# EAGLE design Sensor-TSL2591 (EAGLE 7.7.0)
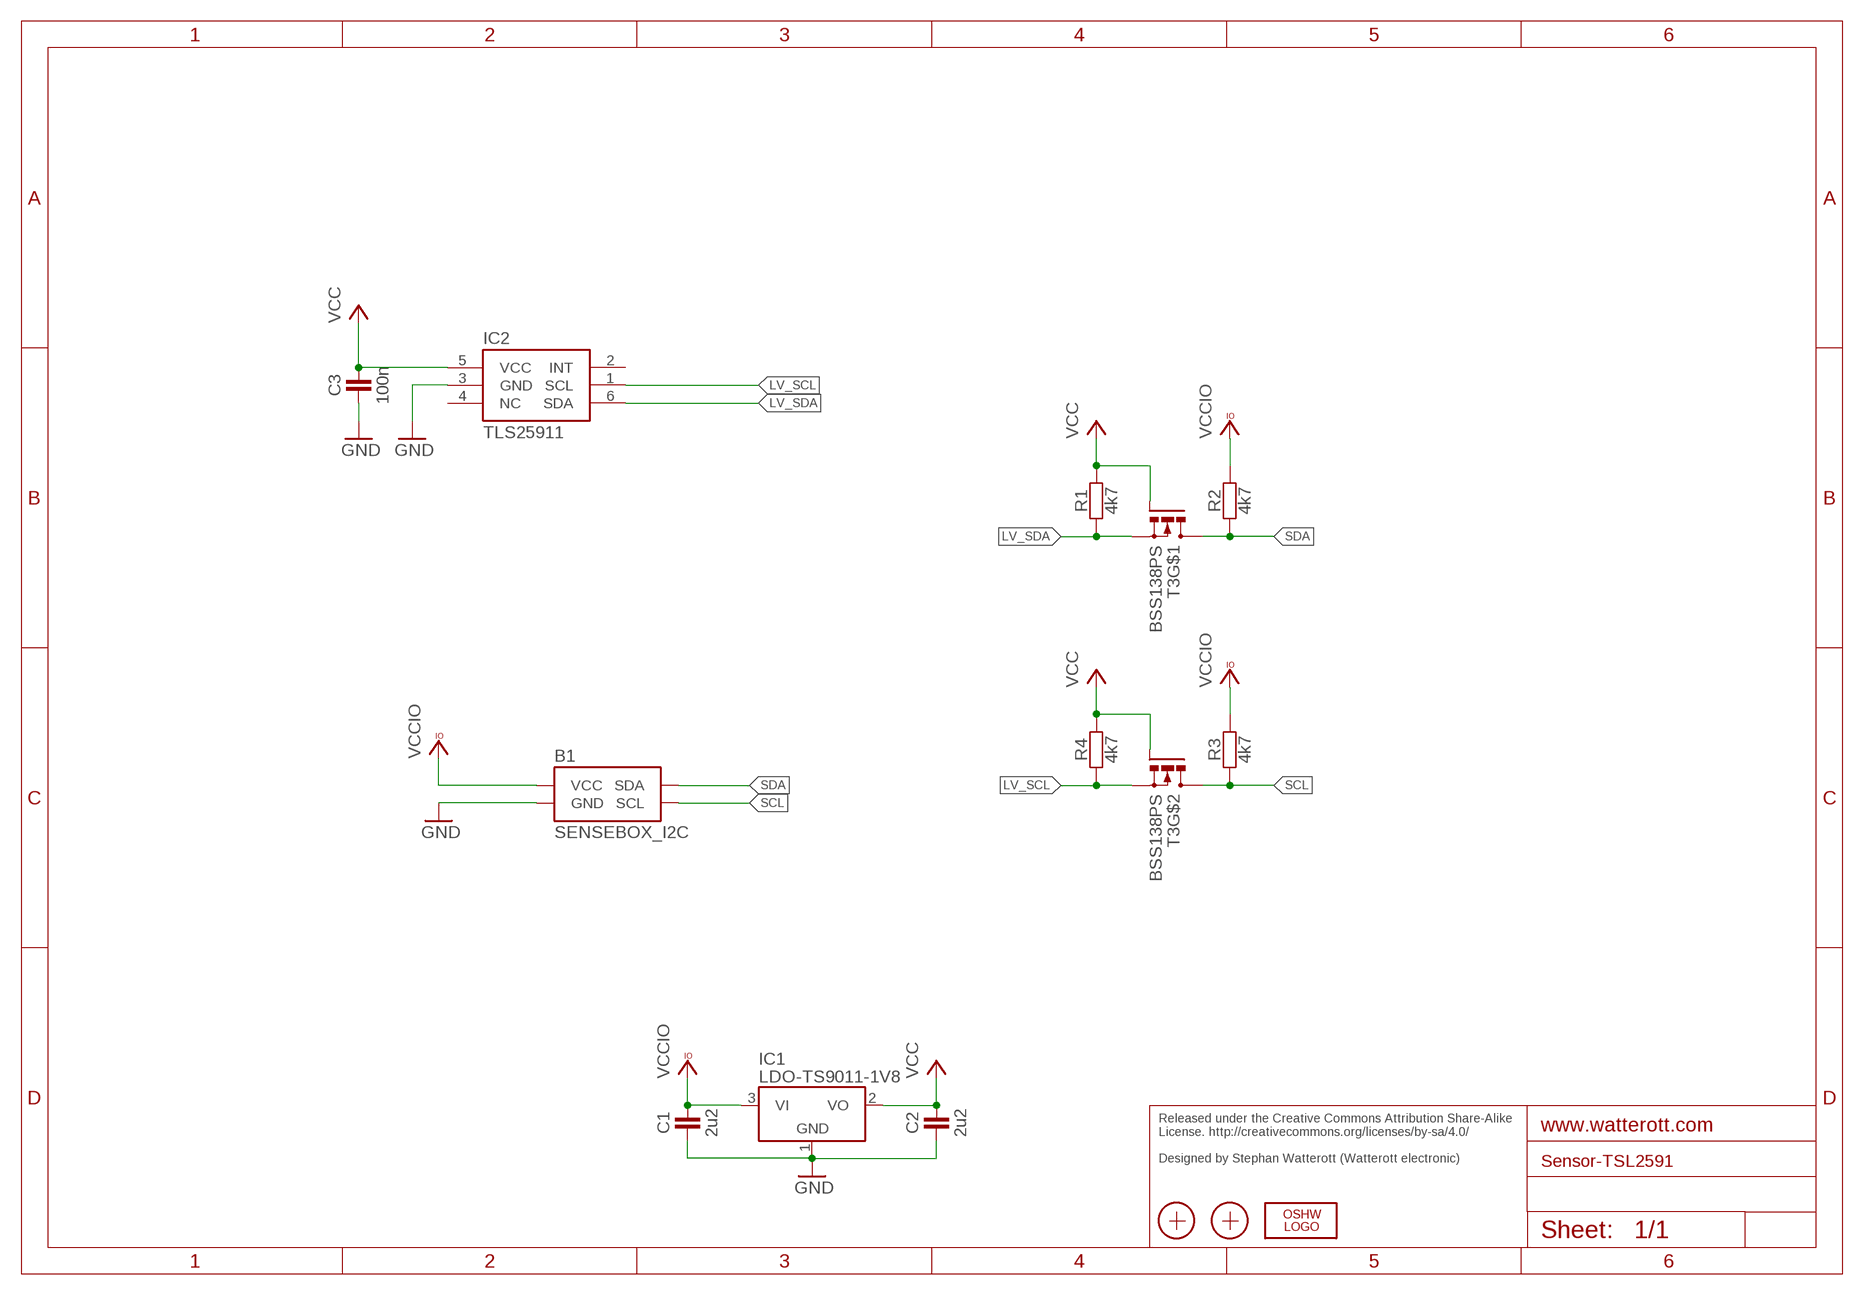
[diagram p0: schematic, sheet 1]

## Parts
B1  SENSEBOX_I2C  [BREAKOUT_SENSEBOX_I2C]
C1  2u2  CAPACITOR-C0402  [R0402]
C2  2u2  CAPACITOR-C0402  [R0402]
C3  100n  CAPACITOR-C0402  [R0402]
IC1  LDO-TS9011-1V8  LDO-TS9011-3V3  [SOT23]
IC2  TLS25911  TLS2591  [WFDFN6]
LOGO2  OSHW_LOGOX0070  [OSHW_6X70]
R1  4k7  RESISTOR-R0402  [R0402]
R2  4k7  RESISTOR-R0402  [R0402]
R3  4k7  RESISTOR-R0402  [R0402]
R4  4k7  RESISTOR-R0402  [R0402]
T3  BSS138PS  [SOT363]
X1  PASSER-07  [PASSER_07MM]
X2  PASSER-07  [PASSER_07MM]

## Nets
GND: B1.GND C1.1 C2.1 C3.1 IC1.1(GND) IC2.3(GND)
LV_SCL: IC2.1(SCL) R4.1 T3.4(S)
LV_SDA: IC2.6(SDA) R1.1 T3.1(S)
SCL: B1.SCL R3.1 T3.3(D)
SDA: B1.SDA R2.1 T3.6(D)
VCC: C2.2 C3.2 IC1.2(VO) IC2.5(VCC) R1.2 R4.2 T3.2(G) T3.5(G)
VCCIO: B1.VCC C1.2 IC1.3(VI) R2.2 R3.2
Unconnected: IC2.2(INT) IC2.4(NC)

## Notes on the sheet
- Released under the Creative Commons Attribution Share-Alike 
  License. http://creativecommons.org/licenses/by-sa/4.0/
  
  Designed by Stephan Watterott (Watterott electronic)

## Library data of the parts
B1 = we-board:SENSEBOX_I2C
C1-C3 = we-rcl:CAPACITOR: Capacitors ...4.7uF @ 6.3V -> 0402 ...10uF @ 16V -> 0603 ...22uF @ 25V -> 0805
IC1 = we-power:LDO: LDOs TS1117 800mA, Vin max 12V TS9011 250mA, Vin max 12V - compatible AP2210 300mA, Vin max 15V TS5204 150mA, Vin max 16V
IC2 = we-sensor:TLS2591: AMS TSL2591 light-to-digital converter
LOGO2 = we-symbol:OSHW_LOGO
R1-R4 = we-rcl:RESISTOR: Resistors all kinds in 0603 and 0402
T3 = we-transistor:BSS138PS
X1 X2 = we-symbol:PASSER

## Board
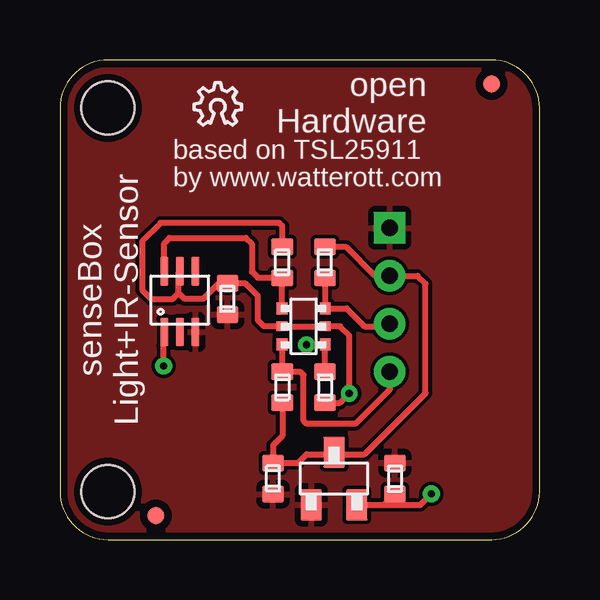
[diagram p1: board, top side]
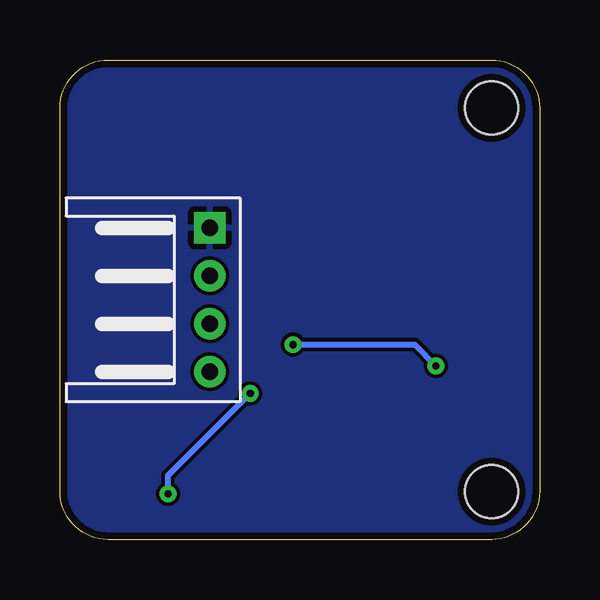
[diagram p2: board, bottom side, seen from below]

Size 20 x 20 mm. Coordinates in mm from the lower left corner, seen from the top.
Copper layers (1*16): Top 0.035mm / dielectric 1.5mm / Bottom 0.035mm
Design rules "we-dru-2-layer *": minimum track width 0.15mm, minimum drill 0.3mm, track to track 0.15mm, track to pad 0.15mm, pad to pad 0.15mm, via to via 0.15mm, smd to smd 0.1mm, copper to edge 0.3mm, drill to drill 0.2mm, minimum pad ring 0.18mm, minimum via ring 0.2mm, stop-mask expansion 0.1mm, vias tented up to drill 0.5mm, thermal gap 0.25mm

### Footprints (pad centres in the part's own frame; a part is rotated, then mirrored left to right if it is on the bottom)
BREAKOUT_SENSEBOX_I2C = drill 0.7 pad 1.3 square: GND 13.75,13 | drill 0.7 pad 1.3: SCL 13.75,7; SDA 13.75,9; VCC 13.75,11 | hole 2.2: 2,18; 2,2
R0402 = smd 0.9 x 0.7: 1 0,0.65; 2 0,-0.65
SOT23 = smd 1.3 x 0.9: 1 -1.1,0.95; 2 -1.1,-0.95; 3 1.1,0
WFDFN6 = smd 1.2 x 0.35: 1 -1.35,0.65; 2 -1.35,0; 3 -1.35,-0.65; 4 1.19,-0.65; 5 1.19,0; 6 1.19,0.65
SOT363 = smd 0.5 x 0.5: 1 -0.9,0.75; 3 -0.9,-0.75; 4 0.9,-0.75; 6 0.9,0.75 | smd 0.5 x 0.4: 2 -0.9,0; 5 0.9,0
PASSER_07MM = smd 0.7 x 0.7: X 0,0

### Placement (x,y rotation side)
B1  0,0 0 top
C1  8.89,2.54 180 top
C2  13.97,2.54 0 top
C3  6.99,10.03 180 top
IC1  11.43,2.54 90 top
IC2  5,10 90 top
LOGO2  5.59,17.27 0 top
R1  9.27,11.56 180 top
R2  11.05,11.56 180 top
R3  9.27,6.35 0 top
R4  11.05,6.35 0 top
T3  10.16,8.89 0 top
X1  4,1 0 top
X2  18,19 0 top

### Tracks (layer width: path | path; a pad name or v marks a point on that pad's centre or on a via)
GND
  pour Bottom: 0,0 20,0 20,20 0,20
  pour Top: 0,0 20,0 20,20 0,20
LV_SCL  (via drill 0.3)
  Top 0.254: R4.1 11.05,8.13 T3.4 10.43,8.14 v10.29,8.13 | v4.32,7.24 4.32,8.62 IC2.1
  Bottom 0.254: v10.29,8.13 5.21,8.13 v4.32,7.24
LV_SDA
  Top 0.254: IC2.6 4.35,12.35 4.57,12.57 7.75,12.57 8,12.32 8,11.18 8.26,10.92 9.26,10.92 R1.1 9.26,10.9 T3.1
SCL
  Top 0.254: T3.3 9.27,8.13 R3.1 9.29,6.99 10.03,6.99 10.16,6.86 10.16,4.95 10.29,4.83 12.32,4.83 13.75,6.26 B1.SCL
SDA
  Top 0.254: B1.SDA 13.64,8.89 12.7,8.89 11.95,9.64 T3.6 11.05,9.65 R2.1
VCC  (via drill 0.3)
  Top 0.254: C2.2 13.52,1.44 IC1.2 15.03,1.44 v15.49,1.91 | 4.95,10.29 5.21,10.03 5.97,10.03 6.62,10.68 C3.2 7,10.67 7.75,10.67 8.26,10.16 8.26,9.14 8.51,8.89 T3.2 T3.5 11.68,8.89 12.06,8.51 12.06,6.6 v12.06,6.1 11.67,5.7 R4.2 | 4.95,10.29 4.95,11.14 IC2.5 | R1.2 9.27,13.08 9.14,13.21 4.19,13.21 3.43,12.45 3.43,10.41 3.81,10.03 4.7,10.03 4.95,10.29
  Bottom 0.254: v15.49,1.91 15.49,2.67 v12.06,6.1
VCCIO
  Top 0.254: R2.2 11.06,12.19 11.94,12.19 13.13,11 B1.VCC 14.91,11 15.24,10.67 15.24,6.1 12.7,3.56 11.35,3.56 | R3.2 9.27,4.32 8.89,3.94 C1.2 9.92,3.19 10.29,3.56 11.35,3.56 | 11.35,3.56 IC1.3

### Text on the board
tPlace: open / Hardware | based on TSL25911 | by www.watterott.com | senseBox / Light+IR-Sensor